# EAGLE design 1 (EAGLE 8.5.0)
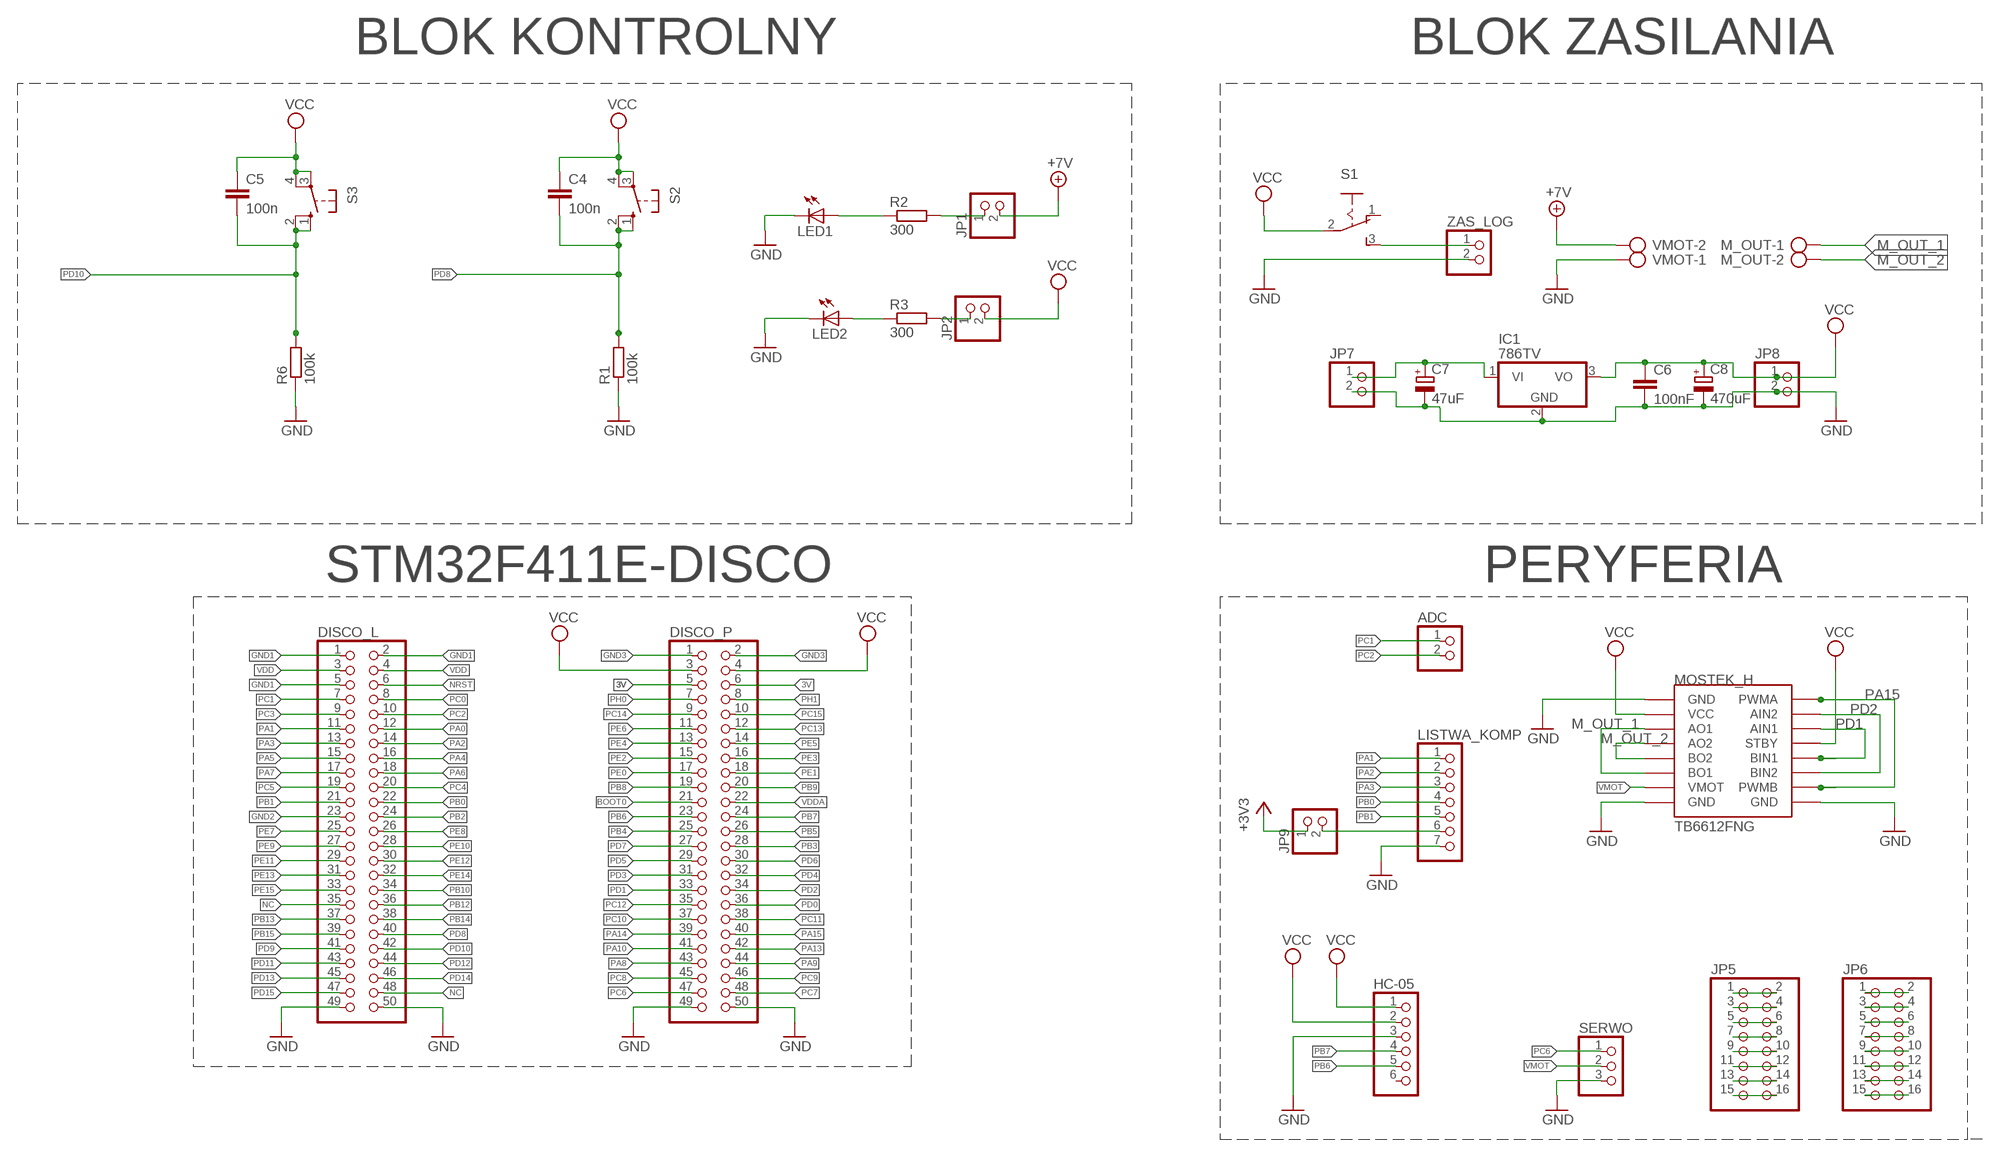
[diagram p0: schematic, sheet 1]

## Parts
ADC  PINHD-1X2  [1X02]
C4  100n  C-EUC1206  [C1206]
C5  100n  C-EUC1206  [C1206]
C6  100nF  C-EU025-025X050  [C025-025X050]
C7  47uF  CPOL-EUTAP5-45  [TAP5-45]
C8  470uF  CPOL-EUTAP5-45  [TAP5-45]
DISCO_L  PINHD-2X25  [2X25]
DISCO_P  PINHD-2X25  [2X25]
HC-05  PINHD-1X6  [1X06]
IC1  786TV  [TO220V]
JP1  PINHD-1X2  [1X02]
JP2  PINHD-1X2  [1X02]
JP5  PINHD-2X8  [2X08]
JP6  PINHD-2X8  [2X08]
JP7  PINHD-1X2  [1X02]
JP8  PINHD-1X2  [1X02]
JP9  PINHD-1X2  [1X02]
LED1  LED5MM  [LED5MM]
LED2  LED5MM  [LED5MM]
LISTWA_KOMP  PINHD-1X7  [1X07]
M_OUT  AK300/2  [AK300/2]
MOSTEK_H  MODUL_POLOLU  [MODUL_POLOLU]
R1  100k  R-EU_R0805  [R0805]
R2  300  R-EU_R0805  [R0805]
R3  300  R-EU_R0805  [R0805]
R6  100k  R-EU_R0805  [R0805]
S1  255SB  [255SB]
S2  10-XX  [B3F-10XX]
S3  10-XX  [B3F-10XX]
SERWO  PINHD-1X3  [1X03]
VMOT  AK300/2  [AK300/2]
ZAS_LOG  PINHD-1X2/90  [1X02/90]

## Nets
3V: DISCO_P.5 DISCO_P.6 JP9.1 ; supply symbol labelled +3V3
A: JP9.2 LISTWA_KOMP.6
BOOT0: DISCO_P.21
GND: C6.2 C7.- C8.- DISCO_L.49 DISCO_L.50 HC-05.3 IC1.2(GND) JP7.2 JP8.2 LED1.K(C) LED2.K(C) LISTWA_KOMP.7 MOSTEK_H.GND1(GND) MOSTEK_H.GND2(GND) MOSTEK_H.GND3(GND) R1.1 R6.1 SERWO.3 VMOT.1 ZAS_LOG.2
GND1: DISCO_L.1 DISCO_L.2 DISCO_L.5
GND2: DISCO_L.23
GND3: DISCO_P.1 DISCO_P.2
GNDD: DISCO_P.49 DISCO_P.50 ; supply symbol labelled GND
M_OUT_1: M_OUT.1 MOSTEK_H.AO1 MOSTEK_H.BO1
M_OUT_2: M_OUT.2 MOSTEK_H.A02(AO2) MOSTEK_H.BO2
N$1: JP5.1 JP5.2
N$2: JP5.3 JP5.4
N$3: JP5.5 JP5.6
N$4: JP5.7 JP5.8
N$5: JP5.9 JP5.10
N$6: JP5.11 JP5.12
N$7: JP5.13 JP5.14
N$8: JP5.15 JP5.16
N$9: JP6.1 JP6.2
N$10: JP6.3 JP6.4
N$11: JP6.5 JP6.6
N$12: JP6.7 JP6.8
N$13: JP6.9 JP6.10
N$14: JP6.11 JP6.12
N$15: JP6.13 JP6.14
N$16: JP6.15 JP6.16
N$17: C7.+ IC1.1(VI) JP7.1
N$18: S1.3(S) ZAS_LOG.1
N$19: LED1.A R2.1
N$20: LED2.A R3.1
N$22: JP1.1 R2.2
N$24: JP2.1 R3.2
NC: DISCO_L.35 DISCO_L.48
NRST: DISCO_L.6
PA0: DISCO_L.12
PA1: DISCO_L.11 LISTWA_KOMP.1
PA2: DISCO_L.14 LISTWA_KOMP.2
PA3: DISCO_L.13 LISTWA_KOMP.3
PA4: DISCO_L.16
PA5: DISCO_L.15
PA6: DISCO_L.18
PA7: DISCO_L.17
PA8: DISCO_P.43
PA9: DISCO_P.44
PA10: DISCO_P.41
PA13: DISCO_P.42
PA14: DISCO_P.39
PA15: DISCO_P.40 MOSTEK_H.PWMA MOSTEK_H.PWMB
PB0: DISCO_L.22 LISTWA_KOMP.4
PB1: DISCO_L.21 LISTWA_KOMP.5
PB2: DISCO_L.24
PB3: DISCO_P.28
PB4: DISCO_P.25
PB5: DISCO_P.26
PB6: DISCO_P.23 HC-05.5
PB7: DISCO_P.24 HC-05.4
PB8: DISCO_P.19
PB9: DISCO_P.20
PB10: DISCO_L.34
PB12: DISCO_L.36
PB13: DISCO_L.37
PB14: DISCO_L.38
PB15: DISCO_L.39
PC0: DISCO_L.8
PC1: ADC.1 DISCO_L.7
PC2: ADC.2 DISCO_L.10
PC3: DISCO_L.9
PC4: DISCO_L.20
PC5: DISCO_L.19
PC6: DISCO_P.47 SERWO.1
PC7: DISCO_P.48
PC8: DISCO_P.45
PC9: DISCO_P.46
PC10: DISCO_P.37
PC11: DISCO_P.38
PC12: DISCO_P.35
PC13: DISCO_P.12
PC14: DISCO_P.9
PC15: DISCO_P.10
PD0: DISCO_P.36
PD1: DISCO_P.33 MOSTEK_H.AIN1 MOSTEK_H.BIN1
PD2: DISCO_P.34 MOSTEK_H.AIN2 MOSTEK_H.BIN2
PD3: DISCO_P.31
PD4: DISCO_P.32
PD5: DISCO_P.29
PD6: DISCO_P.30
PD7: DISCO_P.27
PD8: C4.2 DISCO_L.40 R1.2 S2.1(S) S2.2(S1)
PD9: DISCO_L.41
PD10: C5.2 DISCO_L.42 R6.2 S3.1(S) S3.2(S1)
PD11: DISCO_L.43
PD12: DISCO_L.44
PD13: DISCO_L.45
PD14: DISCO_L.46
PD15: DISCO_L.47
PE0: DISCO_P.17
PE1: DISCO_P.18
PE2: DISCO_P.15
PE3: DISCO_P.16
PE4: DISCO_P.13
PE5: DISCO_P.14
PE6: DISCO_P.11
PE7: DISCO_L.25
PE8: DISCO_L.26
PE9: DISCO_L.27
PE10: DISCO_L.28
PE11: DISCO_L.29
PE12: DISCO_L.30
PE13: DISCO_L.31
PE14: DISCO_L.32
PE15: DISCO_L.33
PH0: DISCO_P.7
PH1: DISCO_P.8
VCC: C4.1 C5.1 C6.1 C8.+ DISCO_P.3 DISCO_P.4 HC-05.1 HC-05.2 IC1.3(VO) JP2.2 JP8.1 MOSTEK_H.STBY MOSTEK_H.VCC S1.2(P) S2.3(P) S2.4(P1) S3.3(P) S3.4(P1)
VDD: DISCO_L.3 DISCO_L.4
VDDA: DISCO_P.22
VMOT: JP1.2 MOSTEK_H.VMOT SERWO.2 VMOT.2 ; supply symbol labelled +7V
Unconnected: HC-05.6 S1.1(O)

## Notes on the sheet
- BLOK KONTROLNY | BLOK ZASILANIA
- STM32F411E-DISCO | PERYFERIA

## Library data of the parts
ADC JP1 JP2 JP7-JP9 ZAS_LOG = pinhead:PINHD-1X2: PIN HEADER
C4-C6 = rcl:C-EU: CAPACITOR, European symbol; SPICEPREFIX: C
C7 C8 = rcl:CPOL-EU: POLARIZED CAPACITOR, European symbol; SPICEPREFIX: C
DISCO_L DISCO_P = pinhead:PINHD-2X25: PIN HEADER
HC-05 = pinhead:PINHD-1X6: PIN HEADER
IC1 = linear:78*: Positive VOLTAGE REGULATOR Source: http://cache.national.com/ds/LM/LM78L05.pdf http://www.fairchildsemi.com/ds/LM/LM7805.pdf
JP5 JP6 = pinhead:PINHD-2X8: PIN HEADER
LED1 LED2 = led:LED: LED OSRAM: - CHIPLED LG R971, LG N971, LY N971, LG Q971, LY Q971, LO R971, LY R971 LH N974, LH R974 LS Q976, LO Q976, LY Q976 LO Q996 - Hyper CHIPLED LW Q18S LB Q993, LB Q99A, LB R99A - SideLED LS A670, LO A670, LY A670, LG A670, LP A670 LB A673, LV A673, LT A673, LW A673 LH A674 LY A675 LS A676, LA A676, LO A676, LY A676, LW A676 LS A679, LY A679, LG A679 - Hyper Micro SIDELED® LS Y876, LA Y876, LO Y876, LY Y876 LT Y87S - SmartLED LW L88C, LW L88S LB L89C, LB L89S, LG L890 LS L89K, LO L89K, LY L89K LS L896, LA L896, LO L896, LY L896 - TOPLED LS T670, LO T670, LY T670, LG T670, LP T670 LSG T670, LSP T670, LSY T670, LOP T670, LYG T670 LG T671, LOG T671, LSG T671 LB T673, LV T673, LT T673, LW T673 LH T674 LS T676, LA T676, LO T676, LY T676, LB T676, LH T676, LSB T676, LW T676 LB T67C, LV T67C, LT T67C, LS T67K, LO T67K, LY T67K, LW E67C LS E67B, LA E67B, LO E67B, LY E67B, LB E67C, LV E67C, LT E67C LW T67C LS T679, LY T679, LG T679 LS T770, LO T770, LY T770, LG T770, LP T770 LB T773, LV T773, LT T773, LW T773 LH T774 LS E675, LA E675, LY E675, LS T675 LS T776, LA T776, LO T776, LY T776, LB T776 LHGB T686 LT T68C, LB T68C - Hyper Mini TOPLED® LB M676 - Mini TOPLED Santana® LG M470 LS M47K, LO M47K, LY M47K Source: http://www.osram.convergy.de LUXEON: - LUMILED® LXK2-PW12-R00, LXK2-PW12-S00, LXK2-PW14-U00, LXK2-PW14-V00 LXK2-PM12-R00, LXK2-PM12-S00, LXK2-PM14-U00 LXK2-PE12-Q00, LXK2-PE12-R00, LXK2-PE12-S00, LXK2-PE14-T00, LXK2-PE14-U00 LXK2-PB12-K00, LXK2-PB12-L00, LXK2-PB12-M00, LXK2-PB14-N00, LXK2-PB14-P00, LXK2-PB14-Q00 LXK2-PR12-L00, LXK2-PR12-M00, LXK2-PR14-Q00, LXK2-PR14-R00 LXK2-PD12-Q00, LXK2-PD12-R00, LXK2-PD12-S00 LXK2-PH12-R00, LXK2-PH12-S00 LXK2-PL12-P00, LXK2-PL12-Q00, LXK2-PL12-R00 Source: www.luxeon.com KINGBRIGHT: KA-3528ASYC Source: www.kingbright.com
LISTWA_KOMP = pinhead:PINHD-1X7: PIN HEADER
M_OUT VMOT = con-ptr500:AK300/2: CONNECTOR; OC_FARNELL: unknown; OC_NEWARK: unknown
MOSTEK_H = TB6612FNG:MODUL_POLOLU
R1-R3 R6 = rcl:R-EU_: RESISTOR, European symbol; SPICEPREFIX: R
S1 = switch:255SB: SLIDING SWITCH Distributor Buerklin, 11G810
S2 S3 = switch-omron:10-XX: OMRON SWITCH; MPN: B3F-1000; OC_FARNELL: 176432; OC_NEWARK: 36M3542
SERWO = pinhead:PINHD-1X3: PIN HEADER

## Board
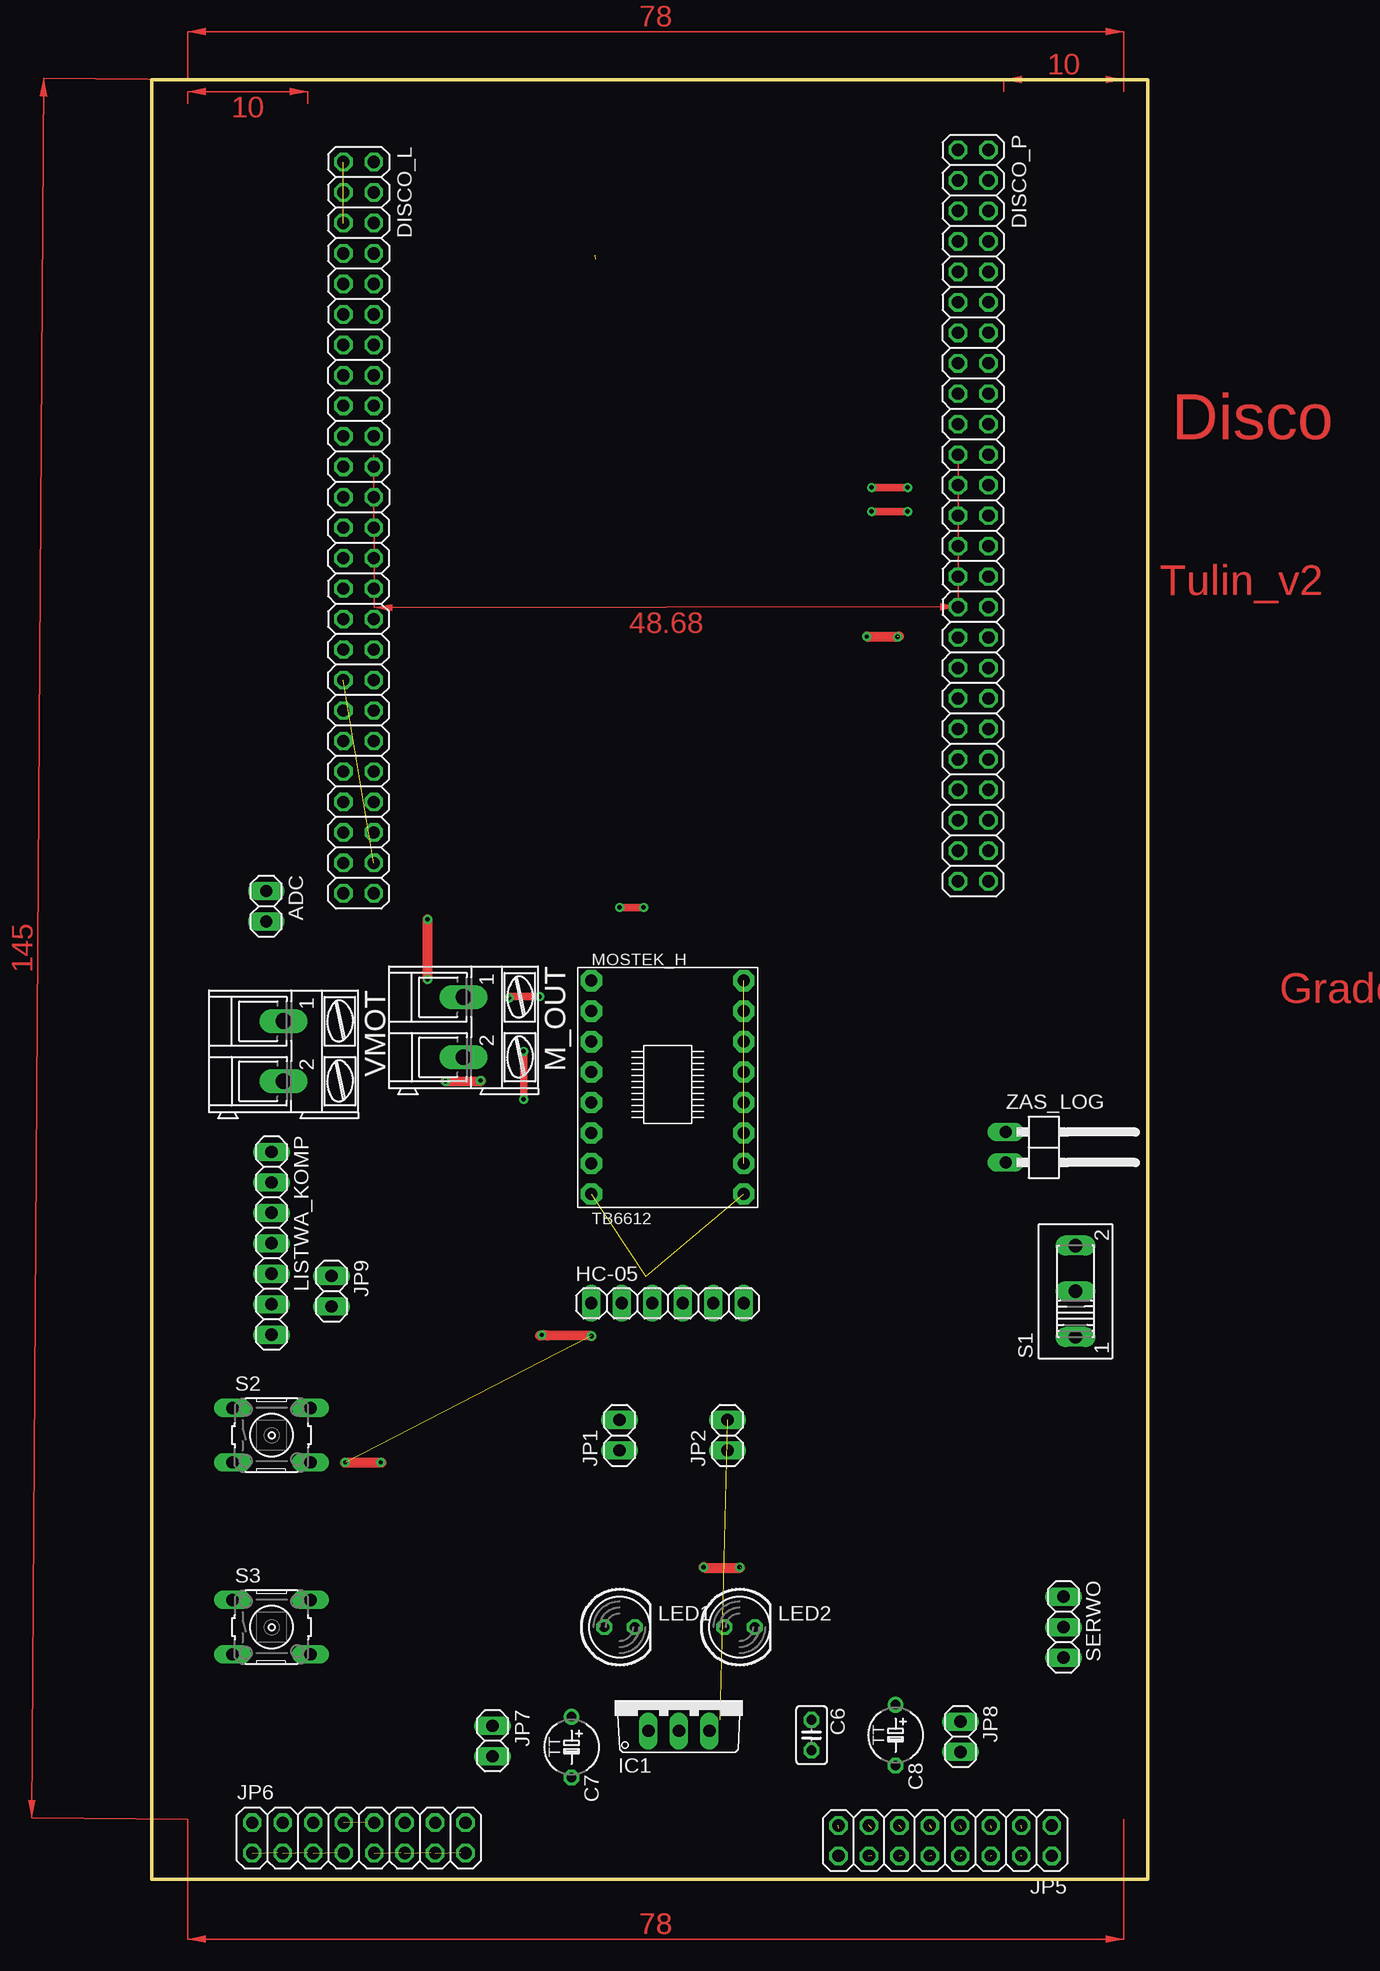
[diagram p1: board, top side]
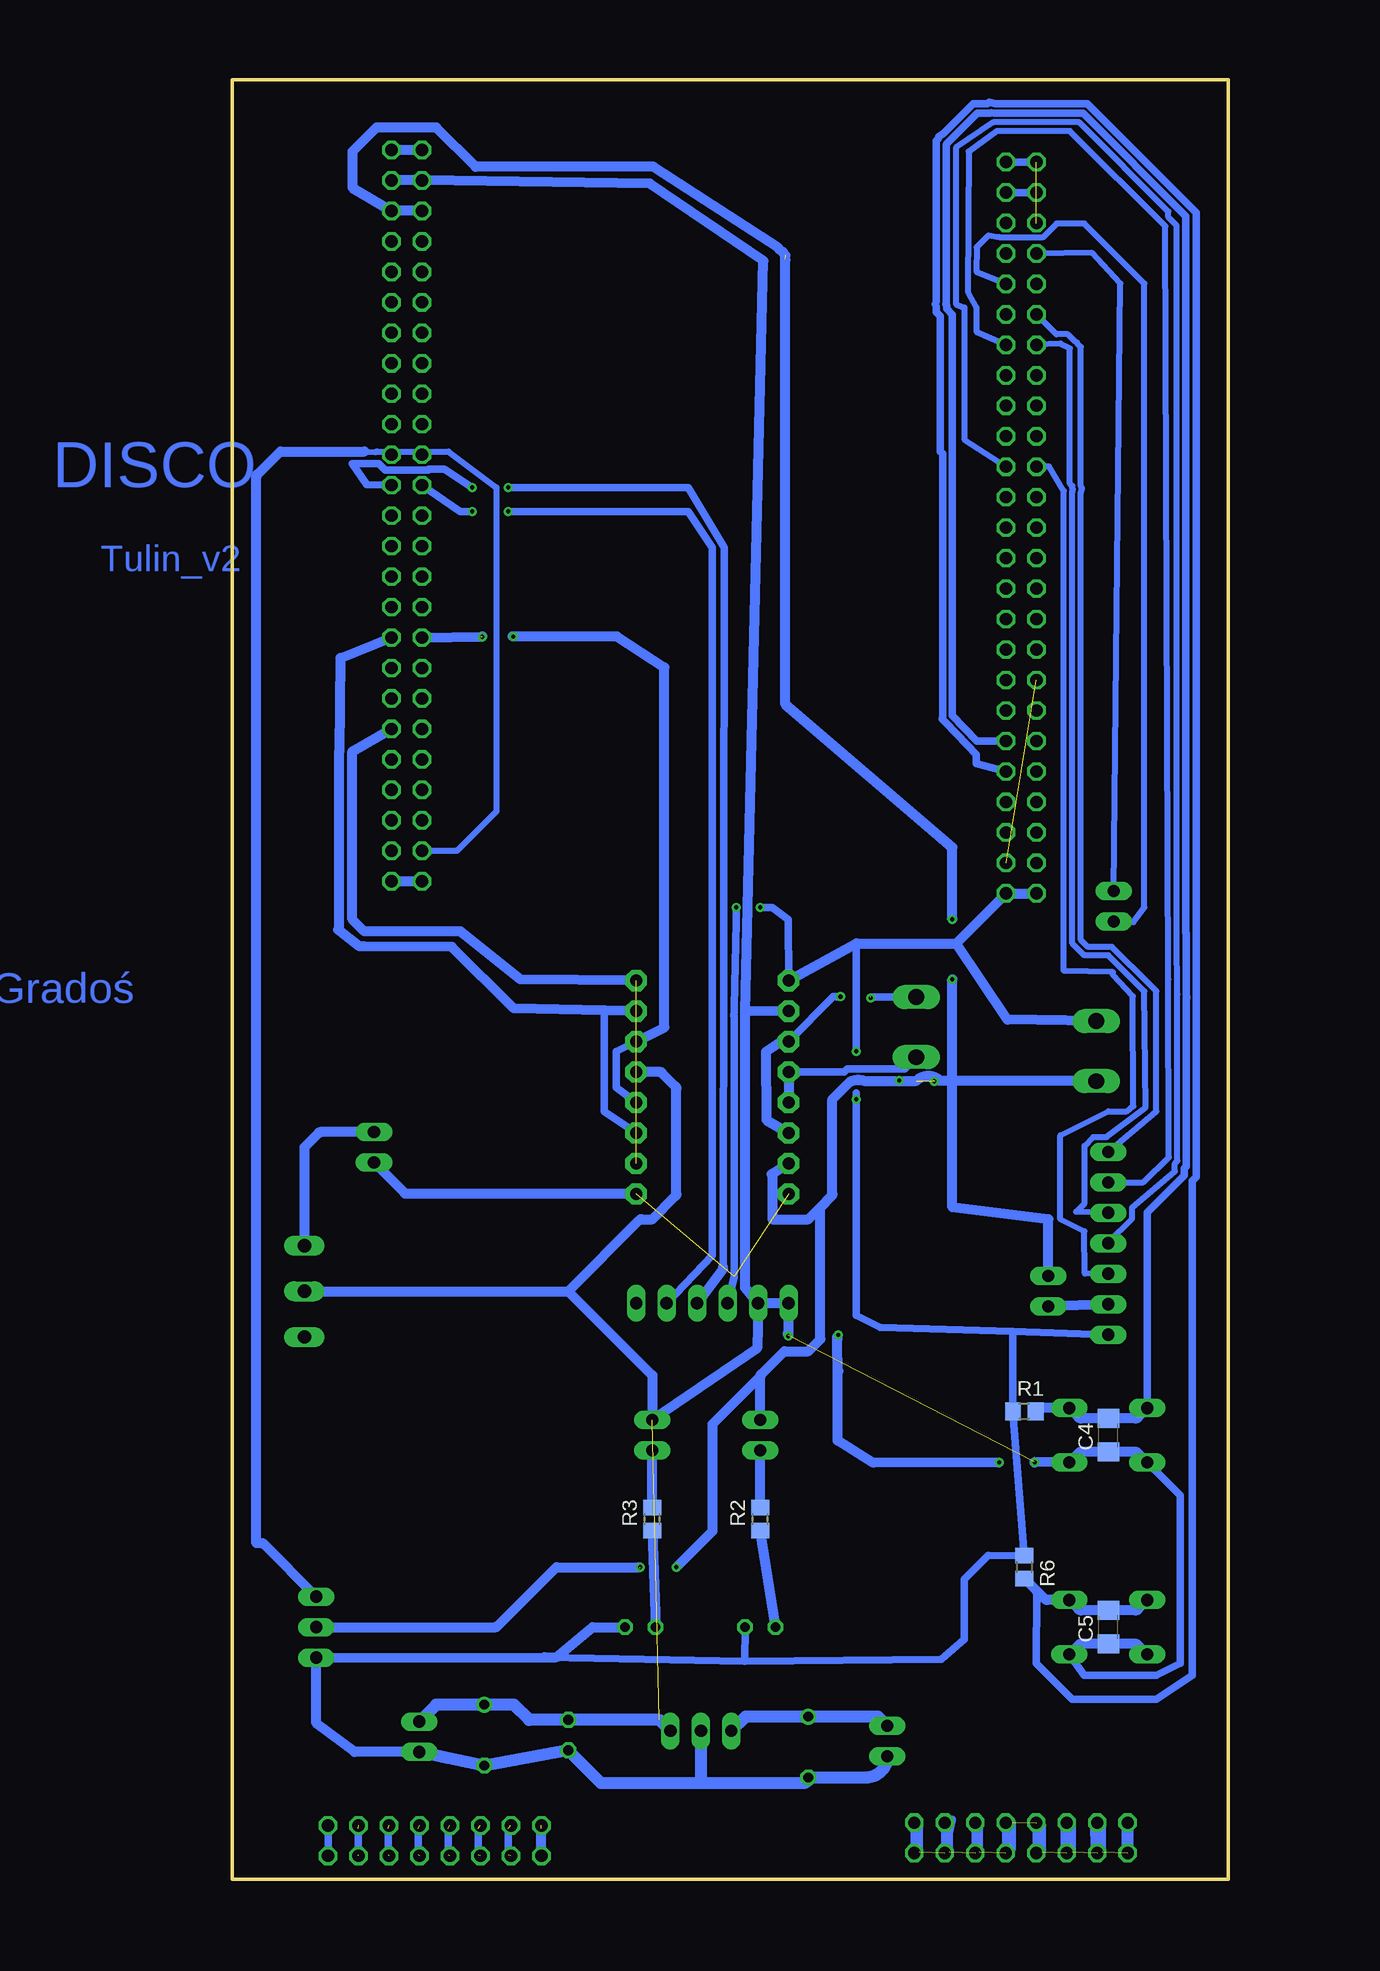
[diagram p2: board, bottom side, seen from below]

Size 83 x 150 mm. Coordinates in mm from the lower left corner, seen from the top.
Outline: 0,0 83,0 83,150 0,150 0,0
Copper layers (1*16): Top 0.035mm / dielectric 1.5mm / Bottom 0.035mm
Design rules "default": minimum track width 10mil, minimum drill 24mil, track to track 8mil, track to pad 8mil, pad to pad 8mil, via to via 8mil, smd to smd 8mil, copper to edge 40mil, drill to drill 8mil, minimum pad ring 10mil, minimum via ring 8mil, stop-mask expansion 4mil, vias tented up to drill 0mil, thermal gap 10mil

### Footprints (pad centres in the part's own frame; a part is rotated, then mirrored left to right if it is on the bottom)
1X02 = drill 1.016 long: 1 -1.27,0; 2 1.27,0
C1206 = smd 1.6 x 1.8: 1 -1.4,0; 2 1.4,0
C025-025X050 = drill 0.813 octagon: 1 -1.27,0; 2 1.27,0
TAP5-45 = drill 0.813: + -2.54,0 | drill 0.813 octagon: - 2.54,0
2X25 = drill 1.016 octagon: 1 -30.48,-1.27; 2 -30.48,1.27; 3 -27.94,-1.27; 4 -27.94,1.27; 5 -25.4,-1.27; 6 -25.4,1.27; 7 -22.86,-1.27; 8 -22.86,1.27; 9 -20.32,-1.27; 10 -20.32,1.27; 11 -17.78,-1.27; 12 -17.78,1.27; 13 -15.24,-1.27; 14 -15.24,1.27; 15 -12.7,-1.27; 16 -12.7,1.27; 17 -10.16,-1.27; 18 -10.16,1.27; 19 -7.62,-1.27; 20 -7.62,1.27; 21 -5.08,-1.27; 22 -5.08,1.27; 23 -2.54,-1.27; 24 -2.54,1.27; 25 0,-1.27; 26 0,1.27; 27 2.54,-1.27; 28 2.54,1.27; 29 5.08,-1.27; 30 5.08,1.27; 31 7.62,-1.27; 32 7.62,1.27; 33 10.16,-1.27; 34 10.16,1.27; 35 12.7,-1.27; 36 12.7,1.27; 37 15.24,-1.27; 38 15.24,1.27; 39 17.78,-1.27; 40 17.78,1.27; 41 20.32,-1.27; 42 20.32,1.27; 43 22.86,-1.27; 44 22.86,1.27; 45 25.4,-1.27; 46 25.4,1.27; 47 27.94,-1.27; 48 27.94,1.27; 49 30.48,-1.27; 50 30.48,1.27
1X06 = drill 1.016 long: 1 -6.35,0; 2 -3.81,0; 3 -1.27,0; 4 1.27,0; 5 3.81,0; 6 6.35,0
TO220V = drill 1.016 long: 1 -2.54,-2.54; 2 0,-2.54; 3 2.54,-2.54
2X08 = drill 1.016 octagon: 1 -8.89,-1.27; 2 -8.89,1.27; 3 -6.35,-1.27; 4 -6.35,1.27; 5 -3.81,-1.27; 6 -3.81,1.27; 7 -1.27,-1.27; 8 -1.27,1.27; 9 1.27,-1.27; 10 1.27,1.27; 11 3.81,-1.27; 12 3.81,1.27; 13 6.35,-1.27; 14 6.35,1.27; 15 8.89,-1.27; 16 8.89,1.27
LED5MM = drill 0.813 octagon: A -1.27,0; K 1.27,0
1X07 = drill 1.016 long: 1 -7.62,0; 2 -5.08,0; 3 -2.54,0; 4 0,0; 5 2.54,0; 6 5.08,0; 7 7.62,0
AK300/2 = drill 1.321 long: 1 -2.515,0; 2 2.489,0
MODUL_POLOLU = drill 1 pad 1.778 octagon: A02 -6.35,1.27; AIN1 6.35,3.81; AIN2 6.35,6.35; AO1 -6.35,3.81; BIN1 6.35,-1.27; BIN2 6.35,-3.81; BO1 -6.35,-3.81; BO2 -6.35,-1.27; GND1 -6.35,8.89; GND2 -6.35,-8.89; GND3 6.35,-8.89; PWMA 6.35,8.89; PWMB 6.35,-6.35; STBY 6.35,1.27; VCC -6.35,6.35; VMOT -6.35,-6.35
R0805 = smd 1.3 x 1.5: 1 -0.95,0; 2 0.95,0
255SB = drill 1.118 long: 1 -3.81,0; 2 0,0; 3 3.81,0
B3F-10XX = drill 1.016 long: 1 -3.251,2.261; 2 3.251,2.261; 3 -3.251,-2.261; 4 3.251,-2.261
1X03 = drill 1.016 long: 1 -2.54,0; 2 0,0; 3 2.54,0
1X02/90 = drill 1.016 long: 1 -1.27,-3.81; 2 1.27,-3.81

### Placement (x,y rotation side)
ADC  9.55,81.08 270 top
C4  10,37 90 bottom
C5  10,21 90 bottom
C6  55,12 270 top
C7  35,11 270 top
C8  62,12 270 top
DISCO_L  17.26,112.65 270 top
DISCO_P  68.47,113.65 270 top
HC-05  43,48 0 top
IC1  43.95,14.89 0 top
JP1  39,37 90 top
JP2  48,37 90 top
JP5  66.13,3.2 180 top
JP6  17.28,3.44 0 top
JP7  28.42,11.51 270 top
JP8  67.42,11.86 270 top
JP9  15,49 270 top
LED1  39,21 0 top
LED2  49,21 0 top
LISTWA_KOMP  10,53 270 top
M_OUT  26,71 270 top
MOSTEK_H  43,66 0 top
R1  17,39 0 bottom
R2  39,30 90 bottom
R3  48,30 90 bottom
R6  17,26 270 bottom
S1  77,49 90 top
S2  10,37 0 top
S3  10,21 0 top
SERWO  76,21 270 top
VMOT  11,69 270 top
ZAS_LOG  75,61 270 top

### Tracks (layer width: path | path; a pad name or v marks a point on that pad's centre or on a via)
3V  (via drill 0.35)  (1 unrouted)
  Top 0.813: v23,75 v23,80
  Bottom 0.813: DISCO_P.5 DISCO_P.6 73,141 73,144 71,146 66,146 62.72,142.72 47.86,142.72 47.8,142.67 37.56,136.01 37.35,135.79 37.09,135.62 37.07,135.5 36.92,135.35 36.92,97.92 23,86 v23,80 | JP9.1 15,55 23,56 v23,75 | 36.92,134.96 36.96,135.01
A
  Bottom 0.813: LISTWA_KOMP.6 JP9.2
GND  (via drill 0.35)  (2 unrouted)
  Top 0.61: v41,81 v39,81 | v31,69 v31,65
  Bottom 0.61: MOSTEK_H.GND1 36.67,79.99 38,81 v39,81 | HC-05.3 41.18,50.24 41.18,71.93 41.19,71.94 41.18,72.31 41.18,72.68 41.17,72.69 41,79.8 | 41,79.8 41,80 | 41,79.8 v41,81 | 31,78 v31,69 | LISTWA_KOMP.7 17.98,45.64 | 17.98,45.64 29,46 31,47 v31,65 31,65.54 | 17.98,45.64 R1.1 R6.1 20,27 22,25 22,20 23.91,18.31 40.31,18.15 | LED1.K 40.31,18.15 | 40.31,18.15 57,18.49
  Bottom 0.813: MOSTEK_H.GND1 31,78 22.69,78 | 22.69,78 DISCO_L.50 DISCO_L.49 | JP8.2 72.8,10.59 76,13 SERWO.3 57,18.49 56,18.49 53,21 LED2.K | VMOT.1 18.41,71.64 22.69,78 | MOSTEK_H.GND3 68.47,57.11 arc45 68.64,57.18 ZAS_LOG.2
  Bottom 1.016: JP7.2 arc90 30.2,8.46 C7.- arc90 35.46,8 44,8 | 44,8 52.27,8 C6.2 C8.- 64.98,10.08 JP8.2 | IC1.2 43.95,8.05 44,8
GND1  (1 unrouted)
  Bottom 0.61: DISCO_L.1 DISCO_L.2
GND3
  Bottom 0.813: DISCO_P.1 DISCO_P.2
GNDD
  Bottom 0.813: DISCO_P.49 DISCO_P.50
M_OUT_1  (via drill 0.35)  (1 unrouted)
  Top 0.61: v32.31,73.55 29.79,73.55 29.7,73.46
  Bottom 0.61: MOSTEK_H.AO1 32.91,73.55 v32.34,73.55 v32.31,73.55 | 32.22,73.55 v32.31,73.55 | v32.31,73.55 32.37,73.49 32.37,73.52 32.61,73.52 | M_OUT.1 29.81,73.52 29.84,73.49
  Bottom 0.813: MOSTEK_H.AO1 37,70 38.53,68.95 38.5,63.28 MOSTEK_H.BO1
M_OUT_2
  Bottom 0.61: MOSTEK_H.A02 32.02,67.27 31.76,67.53 26.98,67.53 M_OUT.2
  Bottom 0.813: MOSTEK_H.A02 MOSTEK_H.BO2
N$1
  Bottom 0.61: JP5.2 JP5.1
N$2  (2 unrouted)
  Bottom 0.61: 72.5,4.25 72.5,2
N$3  (2 unrouted)
  Bottom 0.61: 70,4.25 70,2
N$4  (2 unrouted)
  Bottom 0.61: 67.5,4.25 67.5,2
N$5  (2 unrouted)
  Bottom 0.61: 65,4.25 65,2
N$6  (2 unrouted)
  Bottom 0.61: 62.5,4.25 62.5,2
N$7  (2 unrouted)
  Bottom 0.61: 60,4.25 60,2
N$8  (1 unrouted)
  Bottom 0.61: 57.25,4.25 57.25,2
  Bottom 0.813: JP5.16 57.25,4.25
N$9  (1 unrouted)
  Bottom 0.61: 10.5,4.5 10.5,2.25
  Bottom 1.016: JP6.1 JP6.2
N$10  (1 unrouted)
  Bottom 0.61: 13,4.5 13,2.25
  Bottom 1.016: JP6.3 11,4 JP6.4
N$11  (1 unrouted)
  Bottom 0.61: 15.5,4.5 15.5,2.25
  Bottom 1.016: JP6.5 JP6.6
N$12  (1 unrouted)
  Bottom 0.61: 18,2.5 18,4.75 | JP6.7 JP6.8
N$13  (1 unrouted)
  Bottom 0.61: 20.75,4.5 20.75,2.25 | JP6.9 JP6.10
N$14  (1 unrouted)
  Bottom 0.61: 23.25,4.5 23.25,2.25 | JP6.11 JP6.12
N$15  (1 unrouted)
  Bottom 0.61: 25.75,4.5 25.75,2.25 | JP6.13 23,5 JP6.14 JP6.13
N$16
  Bottom 0.61: JP6.15 JP6.16
N$17
  Bottom 1.016: JP7.1 29.18,13.54 C7.+ 40.22,13.54 IC1.1
N$18
  Bottom 0.813: ZAS_LOG.1 75.62,62.27 arc-45 75.8,62.2 77,61 S1.3
N$19
  Bottom 0.813: LED1.A R2.1
N$20
  Bottom 0.813: R3.1 LED2.A
N$21  (via drill 0.35)
  Top 0.813: v24.5,66.5 27.47,66.54
N$22
  Bottom 0.813: R2.2 JP1.1
N$23  (via drill 0.35)
  other vias: 27.41,66.56
N$24
  Bottom 0.813: R3.2 JP2.1
N$25  (via drill 0.35)
  other vias: 49,26
N$26  (via drill 0.35)
  Top 0.813: v36.66,45.26 33,45.3 32.39,45.31
N$27  (via drill 0.35)
  Top 0.813: v16.13,34.73 v19.09,34.73 19.18,34.73
  Bottom 0.813: v19.09,34.73 29.58,34.7 32.55,36.55 32.55,42 | 32.55,42 32.55,42.39 32.49,42.33 | 32.55,42 32.58,45 32.58,45.26
N$28  (via drill 0.35)
  other vias: 32.51,45.35
N$29  (via drill 0.35)
  other vias: 62.17,103.54
N$30  (via drill 0.35)
  other vias: 29.79,73.43
NC  (1 unrouted)
PA1
  Bottom 0.508: LISTWA_KOMP.1 6,64 6,74.01 6.29,74.3 6.5,74.51 9.7,77.71 11.7,77.71 12.29,78.3 12.29,115.53 12.19,115.94 12.29,116.1 12.29,127.69 12.58,127.98 12.62,128.1 12.78,128.18 13.36,128.77 14.33,128.77 DISCO_L.11
PA2
  Bottom 0.508: LISTWA_KOMP.2 7.1,58.07 4.96,60.17 5,75 5.24,137.76 13.2,145.71 19.3,145.71 21.63,144 21.71,132.29 21,131 21,129 DISCO_L.14
PA3
  Bottom 0.508: LISTWA_KOMP.3 12.69,55.61 11.98,56.32 11.98,61.12 11.27,61.84 10.16,61.84 6.88,64.32 7,74 10,77 12,77 13,78 13,115.62 12.95,115.82 13,115.91 13,116.11 13.2,116.31 13.2,127.6 14,128 DISCO_L.13
PA15  (1 unrouted)
  Bottom 0.813: MOSTEK_H.PWMA 59,75 64,79 72,79 73,80 73,94 DISCO_P.40
PB0
  Bottom 0.508: LISTWA_KOMP.4 10,53.05 8.02,55.03 8.02,55.98 8,56 4.45,58.99 4.45,59.67 4.25,59.87 4.25,73.75 4.3,78.57 4.3,137.82 5,138.52 5,139 12.42,146.42 19.59,146.42 22.71,144.3 22.71,131.29 22,131 22,120 DISCO_L.22
PB1
  Bottom 0.508: LISTWA_KOMP.5 11.96,50.48 12,54 14,55 14,62 10,64 8.48,64 8.18,64.23 7.91,64.43 7.95,73.57 9.61,75.37 9.61,75.6 13.71,75.7 13.71,115.71 14.93,117.75 DISCO_L.21
PB6  (via drill 0.35)
  Top 0.61: v63,114 v60,114
  Bottom 0.61: HC-05.5 43,52 43,111 45,114 v60,114 | DISCO_P.23 64,114 v63,114
PB7  (via drill 0.35)
  Top 0.61: v63,116 v60,116
  Bottom 0.61: 42.1,51 42,111 45,116 v60,116 | DISCO_P.24 71.79,116.23 73,118 70.81,118 70.27,117.46 66.67,117.46 66.61,117.52 65.32,117.52 v63,116
  Bottom 0.813: HC-05.4 42.1,50.87 42.1,51
PC1
  Bottom 0.508: ADC.1 9,133 11.38,135.55 DISCO_L.7
  Bottom 0.813: 15.65,135.74 arc-45 15.82,135.67 DISCO_L.7
PC2
  Bottom 0.508: ADC.2 7.92,79.76 7,81 7,133 12,138 14.31,138 15.48,136.83 19.03,136.83 | 19.03,136.83 19.1,136.9 | 19.03,136.83 20,137 20.97,136.03 20.98,136 20.99,134 DISCO_L.10
PC6
  Bottom 0.508: 72,119 71.07,118.93 arc45 70.89,119 65,119 61,116 61,89 64.22,85.78 arc45 64.39,85.71 DISCO_P.47
  Bottom 0.813: SERWO.1 80.39,27.93 arc-45 80.56,28 81,28 81,116.9 arc45 80.93,117.07 79,119 72,119
PD1  (via drill 0.35)  (1 unrouted)
  Top 0.813: v59.6,103.57 62.28,103.57
  Bottom 0.61: MOSTEK_H.BIN1 51,66 51,69 MOSTEK_H.AIN1
  Bottom 0.813: MOSTEK_H.AIN1 47,71 47,101 50.95,103.57 v59.6,103.57 59.66,103.57 | DISCO_P.33 62.16,103.57
PD2
  Bottom 0.61: MOSTEK_H.BIN2 52,64 51.99,72.41
  Bottom 0.813: MOSTEK_H.AIN2 51.99,72.41 59.54,72.58 64.71,77.71 72.03,77.74 72.41,77.74 74,79 74.19,79.14 74.09,79.24 74.09,93.96 74.05,94 73.98,101.79 DISCO_P.34
PD8
  Bottom 0.61: DISCO_L.40 20.95,94.86 23,97 23,130.41 23.47,130.88 23.47,131.13 23.54,131.28 23.52,131.32 23.52,144.57 23.42,144.67 23.4,144.75 23.2,144.89 20.91,147.18 19.82,147.18 19.76,147.23 19.52,147.18 12.1,147.18 3.54,138.62 3.54,78.88 3.48,78.83 3.48,73.76 3.48,73.45 3.48,73.44 3.48,59.42 3.66,59.24 3.69,58.96 3.69,58.64 4,58.33 6.75,55.58 S2.1
  Bottom 0.813: S2.1 7.54,38.47 arc45 7.71,38.4 C4.2 12.28,38.4 arc45 12.47,38.47 S2.2 15.68,39.26 arc-45 15.86,39.19 R1.2
PD10
  Bottom 0.61: 15.48,23.52 15.62,23.52 15.86,23.77 | S3.2 14,23.26 | 15.98,24.02 16,18 13,15 6,15 3,17 3,58.18 2.67,58.51 2.67,73.11 2.66,73.12 2.66,138.9 11.76,148 19.44,148 19.94,148.09 20.07,148 21.24,148 23.72,145.52 24.14,145.24 24.17,145.07 24.33,144.91 24.33,131.48 24.42,131.28 24.33,131.08 24.33,130.59 24,130.26 24,119 23.81,118.81 23.81,97.01 23.82,96.68 23.81,96.67 23.81,96.66 23.58,96.43 21.76,94.53 21.76,94.51 21,93.75 21,93 DISCO_L.42
  Bottom 0.813: S3.1 7.54,22.47 arc45 7.71,22.4 C5.2 12.28,22.4 arc45 12.47,22.47 S3.2 | 14,23.26 15.1,23.26 arc45 15.28,23.34 15.48,23.52 15.98,24.02 R6.2
VCC  (2 unrouted)
  Bottom 0.61: S3.4 12,17 6,17 4,18 4,32 S2.3
  Bottom 0.813: DISCO_P.4 DISCO_P.3 48.21,141.33 38.74,134.89 40.27,72.3 | MOSTEK_H.VCC 40.27,72.3 | HC-05.2 HC-05.1 36.66,45.31 36.71,45.56 | HC-05.2 40.27,49.3 40.27,72.3 | HC-05.2 39.27,44.25 JP2.2 48,42 55,49 | S1.2 55,49 | 55,49 49.07,54.93 arc45 48.89,55 48,55 46.07,56.93 arc-45 46,57.11 46,65.89 arc-45 46.07,66.07 47.2,67.2 arc-45 47.38,67.27 MOSTEK_H.STBY | S3.3 7.54,19.53 arc-45 7.71,19.6 C5.1 12.28,19.6 arc-45 12.47,19.53 S3.4 | S2.3 7.54,35.53 arc-45 7.71,35.6 C4.1 12.28,35.6 arc-45 12.47,35.53 S2.4 16.17,34.76 16.13,34.71
  Bottom 1.016: IC1.3 47.41,13.27 C6.1 58.27,13.27 59.54,14.54 C8.+ 66.01,14.54 JP8.1
VDD
  Bottom 0.61: DISCO_L.3 DISCO_L.4
VMOT  (via drill 0.35)  (4 unrouted)
  Top 0.813: v46,26 arc45 46.1,25.96 49.04,25.96
  Bottom 0.813: VMOT.2 24,66.53 | 24,66.53 24.11,66.53 | 24,66.53 arc-90 26,66.53 30.37,66.53 arc-45 31.54,66.46 33,65 33,57.11 arc45 33.07,56.93 34,56 | MOSTEK_H.VMOT 38.08,58.74 arc90 38,58.66 38,55 35,55 34,56 | JP1.2 39,41.89 | 39,41.89 arc45 38.93,42.07 37,44 35,44 34,45 34,56 | 39,41.89 42.93,37.97 arc-45 43,37.79 43,29 v46,26 | SERWO.2 61.11,21 arc-45 60.93,21.07 56,26 49.09,26 arc45 49.07,25.99
(copper drawn outside any net)
  shapes: Top area x7

### Text on the board
Top: Disco | Tulin_v2 | Gradoś | H
Bottom: DISCO | Tulin_v2 | Gradoś | H